# EAGLE design PropellerClock (EAGLE 7.5.0)
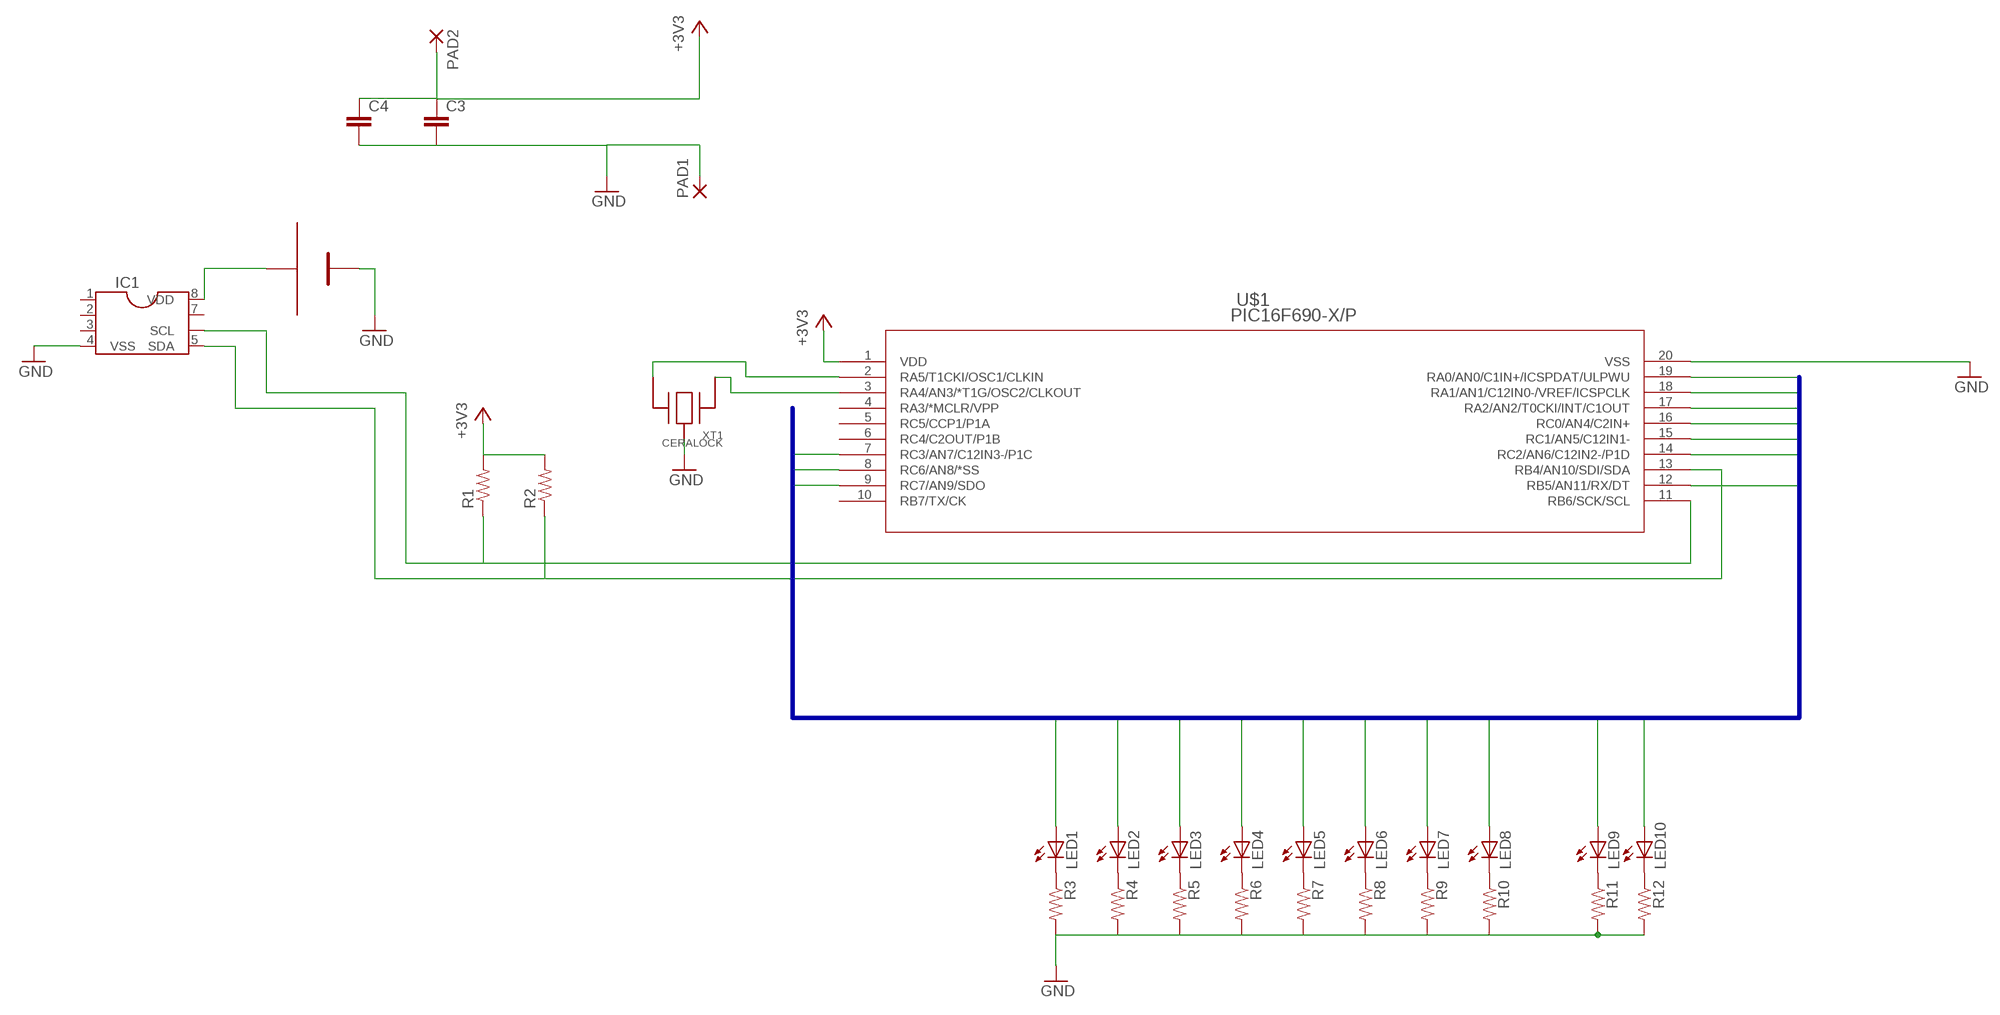
[diagram p0: schematic, sheet 1]

## Parts
C3  C-EUC2012  [C2012]
C4  C-EUC2012  [C2012]
IC1  DIL8S  [SOCKET-08]
LED1  LED3MM  [LED3MM]
LED2  LED3MM  [LED3MM]
LED3  LED3MM  [LED3MM]
LED4  LED3MM  [LED3MM]
LED5  LED3MM  [LED3MM]
LED6  LED3MM  [LED3MM]
LED7  LED3MM  [LED3MM]
LED8  LED3MM  [LED3MM]
LED9  LED3MM  [LED3MM]
LED10  LED3MM  [LED3MM]
PAD1  2,54/1,0  [2,54/1,0]
PAD2  2,54/1,0  [2,54/1,0]
R1  R-US_0204/7  [0204/7]
R2  R-US_0204/7  [0204/7]
R3  R-US_0207/7  [0207/7]
R4  R-US_0207/7  [0207/7]
R5  R-US_0207/7  [0207/7]
R6  R-US_0207/7  [0207/7]
R7  R-US_0207/7  [0207/7]
R8  R-US_0207/7  [0207/7]
R9  R-US_0207/7  [0207/7]
R10  R-US_0207/7  [0207/7]
R11  R-US_0207/7  [0207/7]
R12  R-US_0207/7  [0207/7]
U$1  PIC16F690-X/P  [PDIP20_300MC]
U$2  CR2032-HOLDER2  [CR2032-HOLDER2]
XT1  CERALOCK  [CERALOCK]

## Nets
+3V3 [power]: C3.1 C4.1 PAD2.1(P) R1.2 R2.2 U$1.1(VDD)
GND [GND]: C3.2 C4.2 IC1.4(VSS) PAD1.1(P) R3.2 R4.2 R5.2 R6.2 R7.2 R8.2 R9.2 R10.2 R11.2 R12.2 U$1.20(VSS) U$2.GND XT1.P$2
LED_BUS1: LED1.A U$1.7(RC3/AN7/C12IN3-/P1C)
LED_BUS2: LED2.A U$1.19(RA0/AN0/C1IN+/ICSPDAT/ULPWU)
LED_BUS3: LED3.A U$1.18(RA1/AN1/C12IN0-/VREF/ICSPCLK)
LED_BUS4: LED4.A U$1.17(RA2/AN2/T0CKI/INT/C1OUT)
LED_BUS5: LED5.A U$1.16(RC0/AN4/C2IN+)
LED_BUS6: LED6.A U$1.15(RC1/AN5/C12IN1-)
LED_BUS7: LED7.A U$1.14(RC2/AN6/C12IN2-/P1D)
LED_BUS8: LED8.A U$1.12(RB5/AN11/RX/DT)
LED_BUS9: LED9.A U$1.8(RC6/AN8/*SS)
LED_BUS10: LED10.A U$1.9(RC7/AN9/SDO)
N$2: U$1.3(RA4/AN3/*T1G/OSC2/CLKOUT) XT1.P$1
N$3: U$1.2(RA5/T1CKI/OSC1/CLKIN) XT1.P$3
N$4 [power]: IC1.8(VDD) U$2.+3V
N$5: IC1.5(SDA) R2.1 U$1.13(RB4/AN10/SDI/SDA)
N$8: IC1.6(SCL) R1.1 U$1.11(RB6/SCK/SCL)
N$9: LED1.K(C) R3.1
N$10: LED2.K(C) R4.1
N$11: LED3.K(C) R5.1
N$12: LED4.K(C) R6.1
N$13: LED5.K(C) R7.1
N$14: LED6.K(C) R8.1
N$15: LED7.K(C) R9.1
N$16: LED8.K(C) R10.1
N$17: LED9.K(C) R11.1
N$18: LED10.K(C) R12.1
Unconnected: IC1.1(CLKOE) IC1.2(CLKOUT) IC1.3(INT) IC1.7(V.C.) U$1.4(RA3/*MCLR/VPP) U$1.5(RC5/CCP1/P1A) U$1.6(RC4/C2OUT/P1B) U$1.10(RB7/TX/CK)

## Buses
LED_BUS[1..10]

## Library data of the parts
C3 C4 = rcl:C-EU: CAPACITOR, European symbol
IC1 = RTC-module:DIL8: Dual In Line / Socket
LED1-LED10 = led:LED: LED OSRAM: - CHIPLED LG R971, LG N971, LY N971, LG Q971, LY Q971, LO R971, LY R971 LH N974, LH R974 LS Q976, LO Q976, LY Q976 LO Q996 - Hyper CHIPLED LW Q18S LB Q993, LB Q99A, LB R99A - SideLED LS A670, LO A670, LY A670, LG A670, LP A670 LB A673, LV A673, LT A673, LW A673 LH A674 LY A675 LS A676, LA A676, LO A676, LY A676, LW A676 LS A679, LY A679, LG A679 - Hyper Micro SIDELED® LS Y876, LA Y876, LO Y876, LY Y876 LT Y87S - SmartLED LW L88C, LW L88S LB L89C, LB L89S, LG L890 LS L89K, LO L89K, LY L89K LS L896, LA L896, LO L896, LY L896 - TOPLED LS T670, LO T670, LY T670, LG T670, LP T670 LSG T670, LSP T670, LSY T670, LOP T670, LYG T670 LG T671, LOG T671, LSG T671 LB T673, LV T673, LT T673, LW T673 LH T674 LS T676, LA T676, LO T676, LY T676, LB T676, LH T676, LSB T676, LW T676 LB T67C, LV T67C, LT T67C, LS T67K, LO T67K, LY T67K, LW E67C LS E67B, LA E67B, LO E67B, LY E67B, LB E67C, LV E67C, LT E67C LW T67C LS T679, LY T679, LG T679 LS T770, LO T770, LY T770, LG T770, LP T770 LB T773, LV T773, LT T773, LW T773 LH T774 LS E675, LA E675, LY E675, LS T675 LS T776, LA T776, LO T776, LY T776, LB T776 LHGB T686 LT T68C, LB T68C - Hyper Mini TOPLED® LB M676 - Mini TOPLED Santana® LG M470 LS M47K, LO M47K, LY M47K Source: http://www.osram.convergy.de LUXEON: - LUMILED® LXK2-PW12-R00, LXK2-PW12-S00, LXK2-PW14-U00, LXK2-PW14-V00 LXK2-PM12-R00, LXK2-PM12-S00, LXK2-PM14-U00 LXK2-PE12-Q00, LXK2-PE12-R00, LXK2-PE12-S00, LXK2-PE14-T00, LXK2-PE14-U00 LXK2-PB12-K00, LXK2-PB12-L00, LXK2-PB12-M00, LXK2-PB14-N00, LXK2-PB14-P00, LXK2-PB14-Q00 LXK2-PR12-L00, LXK2-PR12-M00, LXK2-PR14-Q00, LXK2-PR14-R00 LXK2-PD12-Q00, LXK2-PD12-R00, LXK2-PD12-S00 LXK2-PH12-R00, LXK2-PH12-S00 LXK2-PL12-P00, LXK2-PL12-Q00, LXK2-PL12-R00 Source: www.luxeon.com KINGBRIGHT: KA-3528ASYC Source: www.kingbright.com
PAD1 PAD2 = wirepad:2,54/1,0: THROUGH-HOLE PAD
R1-R12 = rcl:R-US_: RESISTOR, American symbol
U$1 = pic16f690_p:PIC16F690-X/P
U$2 = CR2032-holder:CR2032-HOLDER2
XT1 = serolock:CERALOCK

## Net classes
1 power: width 1 mm
2 GND: width 1 mm

## Board
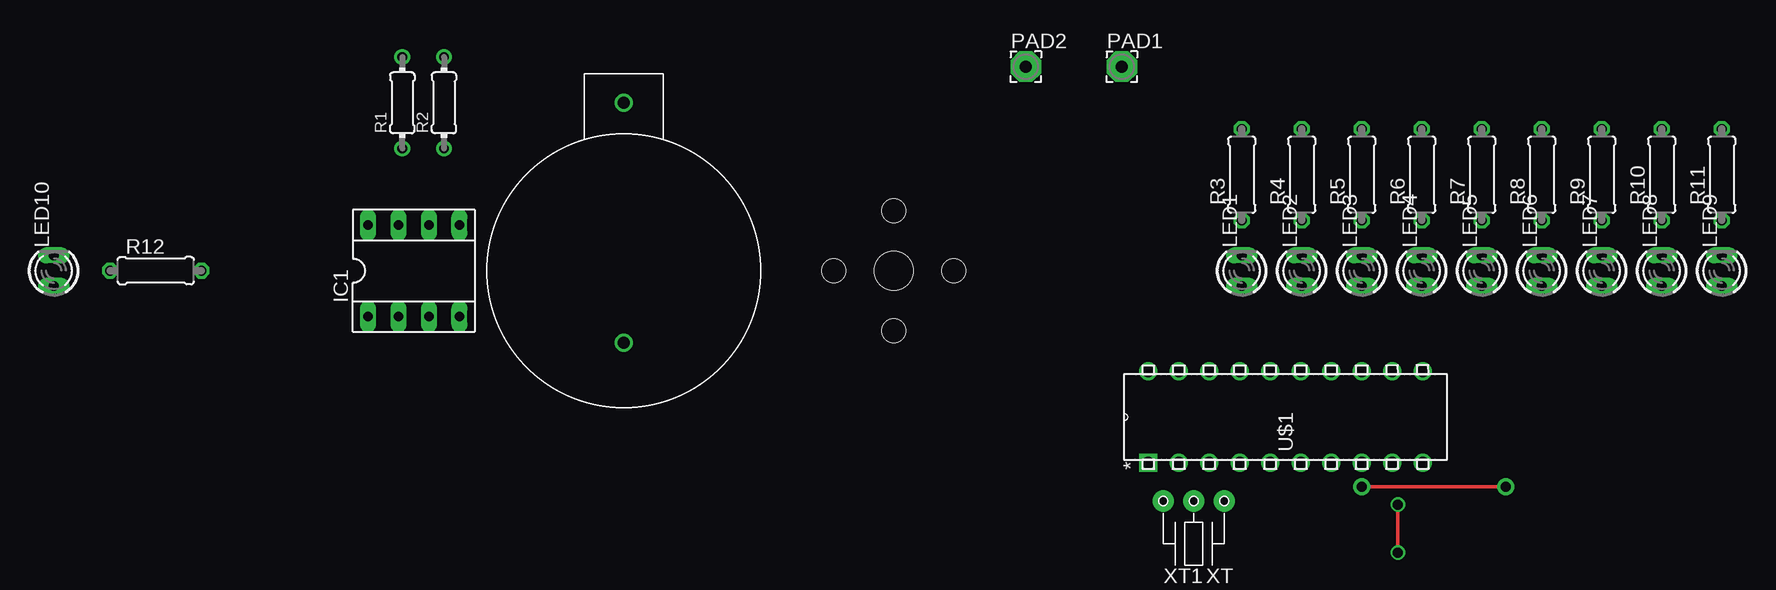
[diagram p1: board, top side]
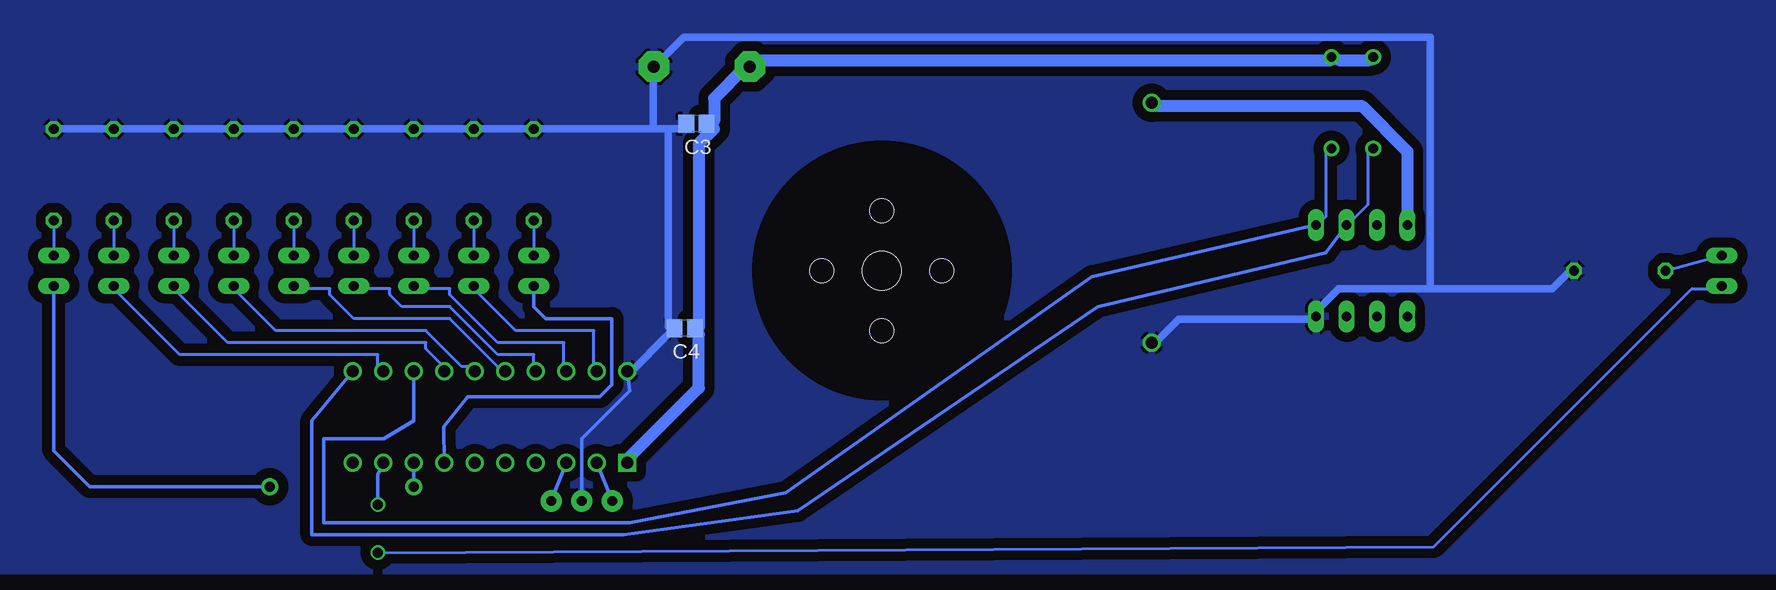
[diagram p2: board, bottom side, seen from below]

No outline drawn. Coordinates in mm, seen from the top.
Copper layers (1*16): Top 0.035mm / dielectric 1.5mm / Bottom 0.035mm
Design rules "default *": minimum track width 10mil, minimum drill 24mil, track to track 15mil, track to pad 15mil, pad to pad 15mil, via to via 15mil, smd to smd 15mil, copper to edge 40mil, drill to drill 8mil, minimum pad ring 10mil, minimum via ring 8mil, stop-mask expansion 4mil, vias tented up to drill 0mil, thermal gap 10mil
Holes 3.2 mm at 80,25
Holes 2 mm at 80,20 80,30 85,25 75,25
tRestrict: area 70,15 to 90,35
bRestrict: area 70,15 to 90,35

### Footprints (pad centres in the part's own frame; a part is rotated, then mirrored left to right if it is on the bottom)
C2012 = smd 1.3 x 1.5: 1 -0.85,0; 2 0.85,0
SOCKET-08 = drill 0.813 long: 1 -3.81,-3.81; 2 -1.27,-3.81; 3 1.27,-3.81; 4 3.81,-3.81; 5 3.81,3.81; 6 1.27,3.81; 7 -1.27,3.81; 8 -3.81,3.81
LED3MM = drill 0.813 long: A -1.27,0; K 1.27,0
2,54/1,0 = drill 1.016 pad 2.54 octagon: 1 0,0
0204/7 = drill 0.813: 1 -3.81,0; 2 3.81,0
0207/7 = drill 0.813 octagon: 1 -3.81,0; 2 3.81,0
PDIP20_300MC = drill 0.991 square: 1 -7.62,22.86 | drill 0.991: 2 -7.62,20.32; 3 -7.62,17.78; 4 -7.62,15.24; 5 -7.62,12.7; 6 -7.62,10.16; 7 -7.62,7.62; 8 -7.62,5.08; 9 -7.62,2.54; 10 -7.62,0; 11 0,0; 12 0,2.54; 13 0,5.08; 14 0,7.62; 15 0,10.16; 16 0,12.7; 17 0,15.24; 18 0,17.78; 19 0,20.32; 20 0,22.86
CR2032-HOLDER2 = drill 1: +3V 0,-14; GND 0,6
CERALOCK = drill 0.813 pad 1.778: P$1 -2.54,-3.81; P$2 0,-3.81; P$3 2.54,-3.81

### Placement (x,y rotation side)
C3  95.44,37.23 180 bottom
C4  96.42,20.2 180 bottom
IC1  40,25 0 top
LED1  109,25 90 top
LED2  114,25 90 top
LED3  119,25 90 top
LED4  124,25 90 top
LED5  129,25 90 top
LED6  134,25 90 top
LED7  139,25 90 top
LED8  144,25 90 top
LED9  149,25 90 top
LED10  10,25 90 top
PAD1  99,42 0 top
PAD2  91,42 0 top
R1  39.05,38.99 90 top
R2  42.52,38.99 90 top
R3  109,33 90 top
R4  114,33 90 top
R5  119,33 90 top
R6  124,33 90 top
R7  129,33 90 top
R8  134,33 90 top
R9  139,33 90 top
R10  144,33 90 top
R11  149,33 90 top
R12  18.5,25 0 top
U$1  124.08,16.61 90 top
U$2  57.5,25 180 top
XT1  105,2 180 top

### Tracks (layer width: path | path; a pad name or v marks a point on that pad's centre or on a via)
+3V3
  Bottom 0.991: U$1.1 100.97,9.53 95.25,15.24 95.25,19.68 C4.1 95.25,20.32 95.25,35.56 93.98,36.83 C3.1 93.98,37.47 93.98,39.37 91.44,41.91 PAD2.1 90.81,42.55 42.55,42.55 R2.2 41.91,42.55 39.37,42.55 R1.2
GND
  Bottom 0.305: XT1.P$2 105,11 101,15 U$1.20
  Bottom 0.61: R11.2 148.59,36.83 144.15,36.83 R10.2 143.51,36.83 139.06,36.83 R9.2 138.43,36.83 134.62,36.83 R8.2 133.99,36.83 129.54,36.83 R7.2 128.91,36.83 124.46,36.83 R6.2 123.83,36.83 119.38,36.83 R5.2 118.75,36.83 114.3,36.83 R4.2 113.67,36.83 109.22,36.83 R3.2 108.58,36.83 99.06,36.83 | U$1.20 100.97,16.51 97.79,19.68 C4.2 97.79,20.32 97.79,36.83 | 99.06,36.83 97.79,36.83 | 97.79,36.83 96.52,36.83 C3.2 | 99.06,36.83 99.06,41.91 PAD1.1 98.42,42.55 96.52,44.45 34.29,44.45 34.29,23.5 | 34.29,23.5 41.91,23.5 43.81,21.59 IC1.4 43.81,20.95 55.24,20.95 57.15,19.05 U$2.GND | 34.29,23.5 24.13,23.5 22.86,24.77 R12.2
  pour Bottom (isolate 0.813): -0.5,49.5 160,49.5 160,0 0,0 0,-0.5
LED_BUS1
  Bottom 0.305: LED1.A 109,22 108,21 102.5,21 102.5,15.5 103.5,14.5 114.5,14.5 116.5,12 U$1.7
LED_BUS2
  Bottom 0.254: LED2.A 114,23.5 110.5,20 104,20 104,17 U$1.19
LED_BUS3
  Bottom 0.254: LED3.A 119,23.5 116,23.5 116,23 112,19 106.5,19 106.5,17 U$1.18
LED_BUS4
  Bottom 0.254: LED4.A 124,23.5 121,23.5 121,23 120,22 116,22 112,18 109,18 109,17 U$1.17
LED_BUS5
  Bottom 0.254: LED5.A 129,23.5 126,23.5 126,23 124,21 116,21 111.5,16.5 U$1.16
LED_BUS6
  Bottom 0.254: LED6.A 134,23.5 130.5,20 118,20 115,17 114,17 U$1.15
LED_BUS7
  Bottom 0.254: LED7.A 139,23.5 134.5,19 118,19 118,18.5 116.5,17 U$1.14
LED_BUS8
  Bottom 0.254: LED8.A 144,23.5 138.5,18 122,18 122,17 U$1.12
LED_BUS9  (via drill 0.8 pad 1.42)
  Top 0.305: v119,7 v131,7
  Bottom 0.305: U$1.8 v119,7 | v131,7 146,7 149,10 LED9.A
LED_BUS10  (via drill 0.8)
  Top 0.305: v122,5.5 v122,1.5
  Bottom 0.254: v122,1.5 34,2 12.5,23.5 10,23.5 LED10.A
  Bottom 0.305: U$1.9 122,8 v122,5.5
N$2
  Bottom 0.305: XT1.P$1 U$1.3
N$3
  Bottom 0.305: U$1.2 XT1.P$3
N$4
  Bottom 0.991: IC1.8 36.2,29.21 36.2,34.92 40.01,38.73 57.15,38.73 U$2.+3V
N$5
  Bottom 0.254: IC1.5 43.5,29 43,29.5 43,35 R2.1
  Bottom 0.305: IC1.5 62.5,24.5 88,6.5 101,4 126.5,4 126.5,11 121.5,11 119,12.5 U$1.13
N$8
  Bottom 0.254: IC1.6 41,29 39.5,30.5 39.5,35 R1.1
  Bottom 0.305: IC1.6 43,26.5 62,22 87,5 101.5,3 127.5,3 127.5,12.5 U$1.11
N$9
  Bottom 0.254: R3.1 LED1.K
N$10
  Bottom 0.254: R4.1 LED2.K
N$11
  Bottom 0.254: R5.1 LED3.K
N$12
  Bottom 0.254: R6.1 LED4.K
N$13
  Bottom 0.254: R7.1 LED5.K
N$14
  Bottom 0.254: R8.1 LED6.K
N$15
  Bottom 0.254: R9.1 LED7.K
N$16
  Bottom 0.254: R10.1 LED8.K
N$17
  Bottom 0.254: R11.1 LED9.K
N$18
  Bottom 0.254: R12.1 LED10.K